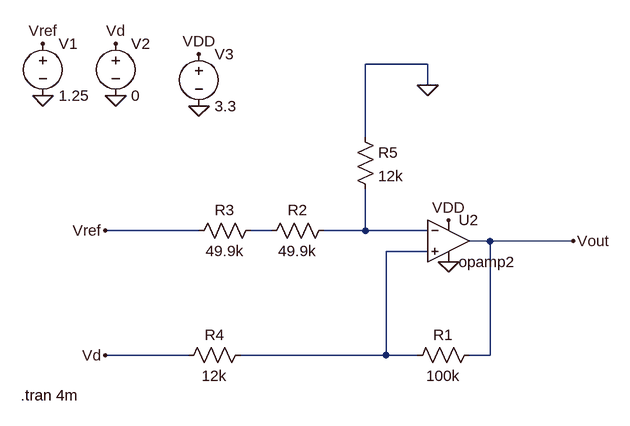
[diagram p0: schematic Draft2.asc]
Draft2.asc, the LTspice schematic file:
Version 4
SHEET 1 880 680
WIRE 160 -112 64 -112
WIRE 160 -80 160 -112
WIRE 64 0 64 -112
WIRE -192 144 -336 144
WIRE -80 144 -112 144
WIRE 64 144 64 80
WIRE 64 144 0 144
WIRE 160 144 64 144
WIRE 256 160 224 160
WIRE 384 160 256 160
WIRE 160 176 96 176
WIRE -208 336 -336 336
WIRE 96 336 96 176
WIRE 96 336 -128 336
WIRE 144 336 96 336
WIRE 256 336 256 160
WIRE 256 336 224 336
FLAG 384 160 Vout
FLAG -336 144 Vref
FLAG -336 336 Vd
FLAG 160 -80 0
FLAG -432 -144 Vref
FLAG -320 -144 Vd
FLAG -320 -64 0
FLAG -432 -64 0
FLAG -192 -128 VDD
FLAG -192 -48 0
FLAG 192 192 0
FLAG 192 128 VDD
SYMBOL res 16 128 R90
WINDOW 0 0 56 VBottom 2
WINDOW 3 32 56 VTop 2
SYMATTR InstName R2
SYMATTR Value 49.9k
SYMBOL res -96 128 R90
WINDOW 0 0 56 VBottom 2
WINDOW 3 32 56 VTop 2
SYMATTR InstName R3
SYMATTR Value 49.9k
SYMBOL res 240 320 R90
WINDOW 0 0 56 VBottom 2
WINDOW 3 32 56 VTop 2
SYMATTR InstName R1
SYMATTR Value 100k
SYMBOL res -112 320 R90
WINDOW 0 0 56 VBottom 2
WINDOW 3 32 56 VTop 2
SYMATTR InstName R4
SYMATTR Value 12k
SYMBOL res 48 -16 R0
SYMATTR InstName R5
SYMATTR Value 12k
SYMBOL voltage -432 -160 R0
WINDOW 123 0 0 Left 0
WINDOW 39 0 0 Left 0
SYMATTR InstName V1
SYMATTR Value 1.25
SYMBOL voltage -320 -160 R0
WINDOW 123 0 0 Left 0
WINDOW 39 0 0 Left 0
SYMATTR InstName V2
SYMATTR Value 0
SYMBOL OpAmps\\opamp2 192 96 R0
SYMATTR InstName U2
SYMBOL voltage -192 -144 R0
WINDOW 123 0 0 Left 0
WINDOW 39 0 0 Left 0
SYMATTR InstName V3
SYMATTR Value 3.3
TEXT -466 398 Left 2 !.tran 4m

The netlist it stands for:
* Draft2.asc
R2 N002 N001 49.9k
R3 N001 Vref 49.9k
R1 Vout N003 100k
R4 N003 Vd 12k
R5 0 N002 12k
V1 Vref 0 1.25
V2 Vd 0 0
XU2 N003 N002 VDD 0 Vout opamp2  ; pins In+ In- V+ V- OUT
V3 VDD 0 3.3
.tran 4m
.backanno
.end